# Altium schematic sheet [2] - POWER.SchDoc: Control Board
size A4; CheckedBy: Rafael Lang; CompanyName: Gear Labs; DrawnBy: Pedro Neves; Organization: Gear Labs; DocumentNumber: 001/2017; Revision: v1.0; SheetNumber: 2; SheetTotal: 6
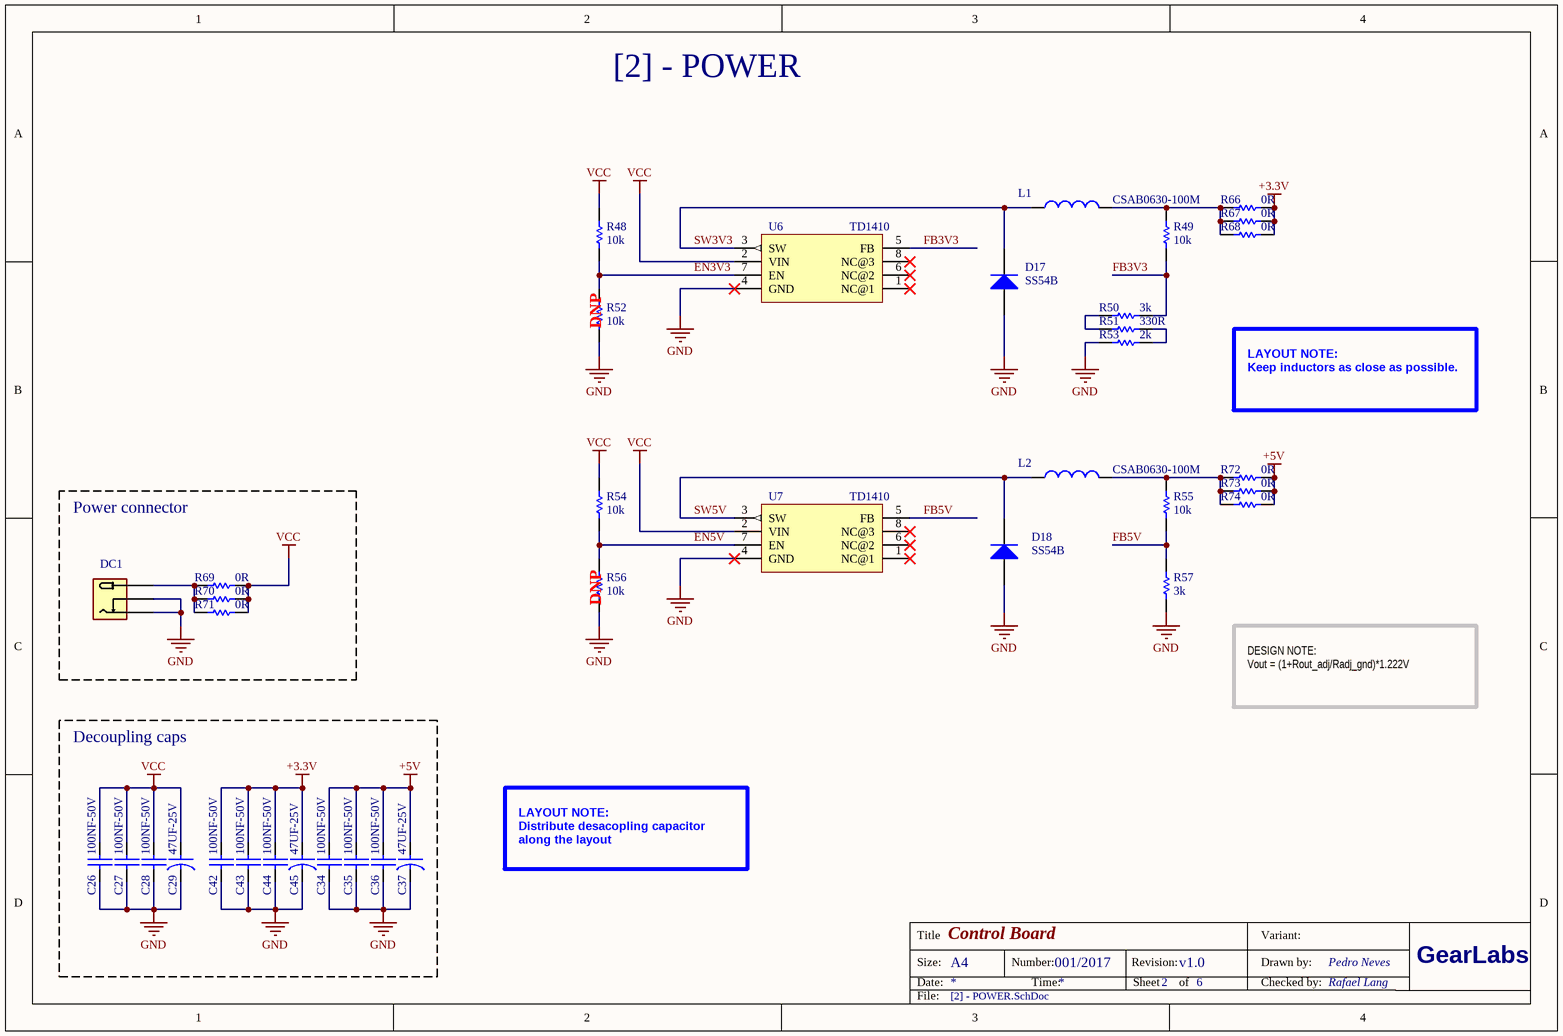
[diagram p0: [2] - POWER.SchDoc]

## Parts
C26  value 100NF-50V  [C0603]  (hidden comment: 302010138)
C27  value 100NF-50V  [C0603]  (hidden comment: 302010138)
C28  value 100NF-50V  [C0603]  (hidden comment: 302010138)
C29  value 47UF-25V  [ELECTRO-SMD-C-6MM]  (hidden comment: 302030059)
C34  value 100NF-50V  [C0603]  (hidden comment: 302010138)
C35  value 100NF-50V  [C0603]  (hidden comment: 302010138)
C36  value 100NF-50V  [C0603]  (hidden comment: 302010138)
C37  value 47UF-25V  [ELECTRO-SMD-C-6MM]  (hidden comment: 302030059)
C42  value 100NF-50V  [C0603]  (hidden comment: 302010138)
C43  value 100NF-50V  [C0603]  (hidden comment: 302010138)
C44  value 100NF-50V  [C0603]  (hidden comment: 302010138)
C45  value 47UF-25V  [ELECTRO-SMD-C-6MM]  (hidden comment: 302030059)
D17  MPN: SS54B  [DO-214AA]  (hidden comment: 304020021)
D18  MPN: SS54B  [DO-214AA]  (hidden comment: 304020021)
DC1  320120003  [3P-L14.2*W11.0*H9.0MM]  (value not drawn)
L1  MPN: CSAB0630-100M  [SMD-2P-L6.0XW6.0XH3.0MM]  (hidden comment: 303010016)
L2  MPN: CSAB0630-100M  [SMD-2P-L6.0XW6.0XH3.0MM]  (hidden comment: 303010016)
R48  value 10k  [R0603]  (hidden comment: 301010293)
R49  value 10k  [R0603]  (hidden comment: 301010299)
R50  value 3k  [R0603]  (hidden comment: 301010170)
R51  value 330R  [R0603]  (hidden comment: 301010300)
R52  value 10k  [R0603]  (hidden comment: 301010293)
R53  value 2k  [R0603]  (hidden comment: 301010221)
R54  value 10k  [R0603]  (hidden comment: 301010293)
R55  value 10k  [R0603]  (hidden comment: 301010299)
R56  value 10k  [R0603]  (hidden comment: 301010293)
R57  value 3k  [R0603]  (hidden comment: 301010170)
R66  value 0R  [R0603]  (hidden comment: 301010292)
R67  value 0R  [R0603]  (hidden comment: 301010292)
R68  value 0R  [R0603]  (hidden comment: 301010292)
R69  value 0R  [R0603]  (hidden comment: 301010292)
R70  value 0R  [R0603]  (hidden comment: 301010292)
R71  value 0R  [R0603]  (hidden comment: 301010292)
R72  value 0R  [R0603]  (hidden comment: 301010292)
R73  value 0R  [R0603]  (hidden comment: 301010292)
R74  value 0R  [R0603]  (hidden comment: 301010292)
U6  TD1410  [SOIC8-1.27-5X4MM]
U7  TD1410  [SOIC8-1.27-5X4MM]

## Blocks framed on the sheet
Power connector: DC1 R69-R71
Decoupling caps: C26-C29 C34-C37 C42-C45

## Nets
+3.3V: C42.1 C43.1 C44.1 C45.+ R66.2 R67.2 R68.2
+5V: C34.1 C35.1 C36.1 C37.+ R72.2 R73.2 R74.2
GND: C26.2 C27.2 C28.2 C29.- C34.2 C35.2 C36.2 C37.- C42.2 C43.2 C44.2 C45.- D17.+ D18.+ DC1.-1(-) DC1.-2(CDN) R52.1 R53.2 R56.1 R57.1 U6.4(GND) U7.4(GND)
VCC: C26.1 C27.1 C28.1 C29.+ R48.2 R54.2 R69.2 R70.2 R71.2 U6.2(VIN) U7.2(VIN)
EN3V3: R48.1 R52.2 U6.7(EN)
EN5V: R54.1 R56.2 U7.7(EN)
FB3V3: R49.1 R50.2 U6.5(FB)
FB5V: R55.1 R57.2 U7.5(FB)
SW3V3: D17.- L1.1 U6.3(SW)
SW5V: D18.- L2.1 U7.3(SW)
NetDC1_+: DC1.+ R69.1 R70.1 R71.1
NetL1_2: L1.2 R49.2 R66.1 R67.1 R68.1
NetL2_2: L2.2 R55.2 R72.1 R73.1 R74.1
NetR50_1: R50.1 R51.2
NetR51_1: R51.1 R53.1

Not connected (* = marked no-connect by the designer): U6 1(NC@1)* 6(NC@2)* 8(NC@3)*; U7 1(NC@1)* 6(NC@2)* 8(NC@3)*

## Notes on the sheet
- [2] - POWER
- (near R52) DNP
- LAYOUT NOTE:
  Keep inductors as close as possible.
- (near R56) DNP
- DESIGN NOTE:
  Vout = (1+Rout_adj/Radj_gnd)*1.222V
- LAYOUT NOTE:
  Distribute desacopling capacitor along the layout
- Title
- Size:
- Date:
- A4
- Number:
- Time:
- Revision:
- Sheet
- of
- Drawn by:
- Checked by:
- Variant:
- GearLabs
- File:

## Library data of the parts
C26-C28 C34-C36 C42-C44 = CERAMIC-100NF-50V-10%-X7R(0603): MPN: CC0603KRX7R9BB104
C29 C37 C45 = ALUMINUM-SMD-47UF-25V(D6.3-H5.3MM): MPN: CS1E470M-CRE54
D17 D18 = SMD-DIODE-SCHOTTKY-28V-5A(DO-214AA)
DC1 = JACK-DC-005'DC-005'
L1 L2 = SMD-INDUCTOR-10UH-20%(2P-6X6MM)'0630'
R48 R52 R54 R56 = SMD-RES-10K-5%-1/10W(0603): MPN: RC0603JR-0710KL
R49 R55 = SMD-RES-10K-1%-1/10W(0603): MPN: RC0603FR-0710KL
R50 R57 = SMD-RES-3K-1%-1/10W(0603): MPN: RC0603FR-073KL
R51 = SMD-RES-330R-1%-1/10W(0603): MPN: RC0603FR-07330RL
R53 = SMD-RES-2K-1%-1/10W(0603): MPN: RC0603FR-072KL
R66-R74 = SMD-RES-0R-5%-1/10W(0603): MPN: RC0603JR-070RL
U6 U7 = PMIC-TD1410(SOIC8): MPN: TD1410